# Altium schematic sheet Relays.SchDoc: USB Relay Module: Relay Outputs
size A4; DrawnBy: Andrew G.; DocumentNumber: 1; Revision: A; SheetNumber: 3; SheetTotal: 3
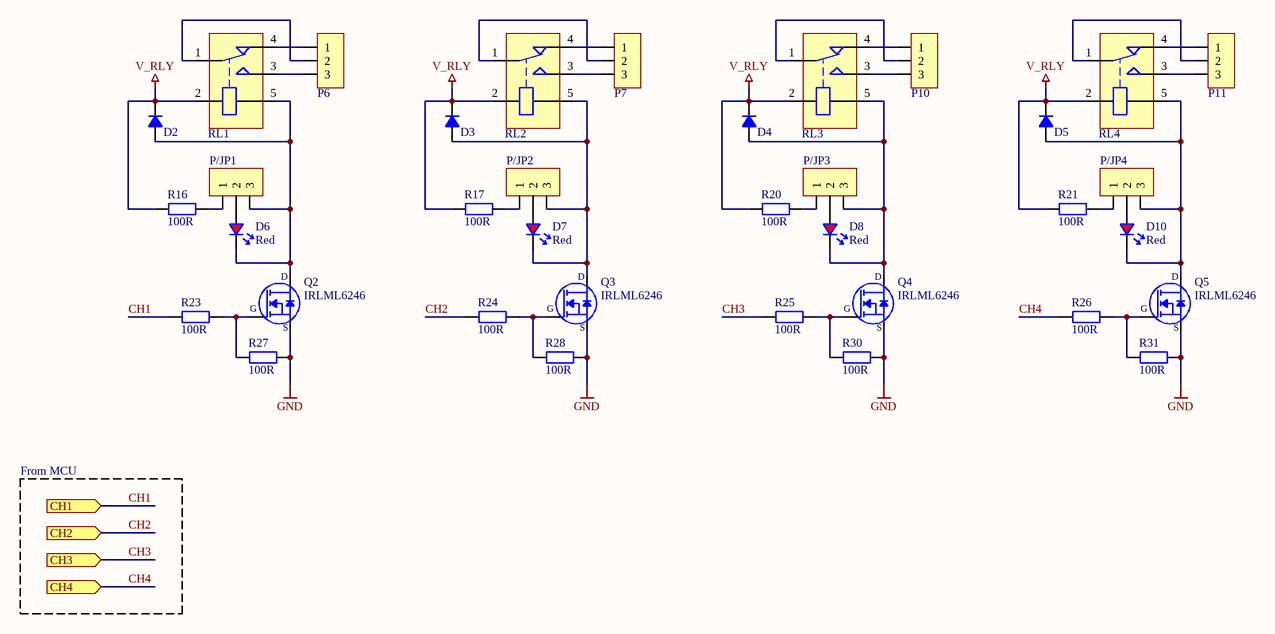
[diagram p0: Relays.SchDoc]

## Parts
D2  D_SM  [DO-214AC]  (value not drawn)
D3  D_SM  [DO-214AC]  (value not drawn)
D4  D_SM  [DO-214AC]  (value not drawn)
D5  D_SM  [DO-214AC]  (value not drawn)
D6  Red  [LED1206]
D7  Red  [LED1206]
D8  Red  [LED1206]
D10  Red  [LED1206]
P6  ED500XDS-3  [ED500XDS-3]  (value not drawn)
P7  ED500XDS-3  [ED500XDS-3]  (value not drawn)
P10  ED500XDS-3  [ED500XDS-3]  (value not drawn)
P11  ED500XDS-3  [ED500XDS-3]  (value not drawn)
P/JP1  PINHDR_3x1  [HEADER-2.54-3P1]  (value not drawn)
P/JP2  PINHDR_3x1  [HEADER-2.54-3P1]  (value not drawn)
P/JP3  PINHDR_3x1  [HEADER-2.54-3P1]  (value not drawn)
P/JP4  PINHDR_3x1  [HEADER-2.54-3P1]  (value not drawn)
Q2  IRLML6246  [SOT-23-127P600-8N]
Q3  IRLML6246  [SOT-23-127P600-8N]
Q4  IRLML6246  [SOT-23-127P600-8N]
Q5  IRLML6246  [SOT-23-127P600-8N]
R16  100R  [R0805]
R17  100R  [R0805]
R20  100R  [R0805]
R21  100R  [R0805]
R23  100R  [R0805]
R24  100R  [R0805]
R25  100R  [R0805]
R26  100R  [R0805]
R27  100R  [R0805]
R28  100R  [R0805]
R30  100R  [R0805]
R31  100R  [R0805]
RL1  *  [SRD-VDC-SL-C]  (value not drawn)
RL2  *  [SRD-VDC-SL-C]  (value not drawn)
RL3  *  [SRD-VDC-SL-C]  (value not drawn)
RL4  *  [SRD-VDC-SL-C]  (value not drawn)

## Ports
CH1 (in), CH2 (in), CH3 (in), CH4 (in)

## Nets
GND: Q2.2(S) Q3.2(S) Q4.2(S) Q5.2(S) R27.1 R28.1 R30.1 R31.1
V_RLY: D2.2(C) D3.2(C) D4.2(C) D5.2(C) R16.2 R17.2 R20.2 R21.2 RL1.2(SW2) RL2.2(SW2) RL3.2(SW2) RL4.2(SW2)
CH1: R23.2 ; port CH1
CH2: R24.2 ; port CH2
CH3: R25.2 ; port CH3
CH4: R26.2 ; port CH4
NetD2_1: D2.1(A) D6.2(C) P/JP1.3 Q2.3(D) RL1.5(SW1)
NetD3_1: D3.1(A) D7.2(C) P/JP2.3 Q3.3(D) RL2.5(SW1)
NetD4_1: D4.1(A) D8.2(C) P/JP3.3 Q4.3(D) RL3.5(SW1)
NetD5_1: D5.1(A) D10.2(C) P/JP4.3 Q5.3(D) RL4.5(SW1)
NetD6_1: D6.1(A) P/JP1.2
NetD7_1: D7.1(A) P/JP2.2
NetD8_1: D8.1(A) P/JP3.2
NetD10_1: D10.1(A) P/JP4.2
NetP6_1: P6.1 RL1.4(NC)
NetP6_2: P6.2 RL1.1(COM)
NetP6_3: P6.3 RL1.3(NO)
NetP7_1: P7.1 RL2.4(NC)
NetP7_2: P7.2 RL2.1(COM)
NetP7_3: P7.3 RL2.3(NO)
NetP10_1: P10.1 RL3.4(NC)
NetP10_2: P10.2 RL3.1(COM)
NetP10_3: P10.3 RL3.3(NO)
NetP11_1: P11.1 RL4.4(NC)
NetP11_2: P11.2 RL4.1(COM)
NetP11_3: P11.3 RL4.3(NO)
NetP/JP1_1: P/JP1.1 R16.1
NetP/JP2_1: P/JP2.1 R17.1
NetP/JP3_1: P/JP3.1 R20.1
NetP/JP4_1: P/JP4.1 R21.1
NetQ2_1: Q2.1(G) R23.1 R27.2
NetQ3_1: Q3.1(G) R24.1 R28.2
NetQ4_1: Q4.1(G) R25.1 R30.2
NetQ5_1: Q5.1(G) R26.1 R31.2

## Notes on the sheet
- From MCU
- Author
- Date
- Revision
- Size
- A4
- Sheet
- of

## Library data of the parts
D2-D5 = D_SM: Generic Diode (Rectifier)
D6-D8 D10 = LED_RED: Generic LED (Red); ForwardVoltage: 1.8V; EmittingColor: Red
P6 P7 P10 P11 = ED500XDS-3: TERM BLK 3P SIDE ENT 5.08MM PCB; Part No: EDZ500/3DS; Rated Current: 15A; Voltage: 300V; URL: https://www.digikey.com/en/products/detail/on-shore-technology-inc/EDZ500-3DS/250583; Datasheet: http://www.on-shore.com/wp-content/uploads/ED500XDS.pdf; Mounting Technology: HMT
P/JP1-P/JP4 = PINHDR_3x1: Generic Pin Header 3x1
Q2-Q5 = IRLML6246TRPBF: MOSFET N-CH 20V 4.1A SOT-23; PartNo: IRLML6246TRPBFCT-ND; Manufacturer: Infineon Technologies; ShippingPackage: Cut Tape (CT); DetailedDescription: N-Channel 4.1A (Ta) 1.3W (Ta) Surface Mount Micro3™ SOT-23; ProductNumber: IRLML6246TRPBF; Supplier: DigiKey; UnitPrice: $0.38; URL: https://www.digikey.com/en/products/detail/infineon-technologies/IRLML6246TRPBF/2393874; Packaging: SOT-23-3; BaseProduct: IRLML6246
R16 R17 R20 R21 R23-R28 R30 R31 = R: Generic Resistor; Tolerance: 1%; Value: 100R; MountingTechnology: SMT; BaseProduct: *
RL1-RL4 = RELAY-SPDT: General Purpose Power Relay SPDT (1 Form C); Coil Voltage: 12VDC; Coil Type: Non Latching; Switching Voltage: 240VAC 24VDC; Contact Current: 10A; Contact Form: SPDT (1 Form C); Mounting Technology: HMT; Product Number: *